# EAGLE schematic EAA690_RFID_Door (EAGLE 7.3.0)
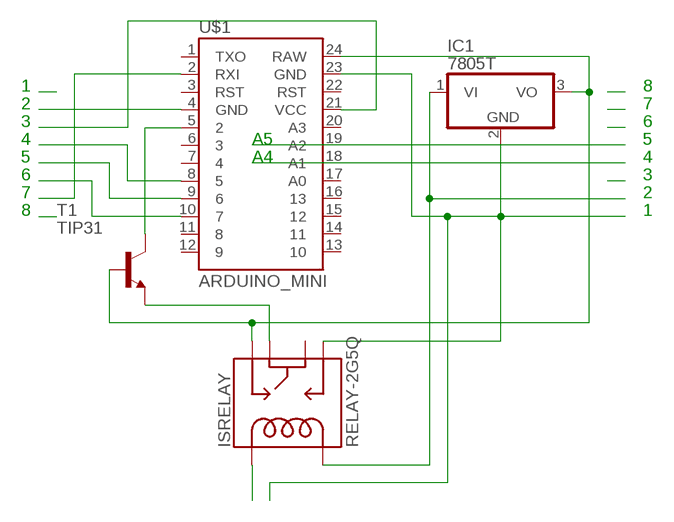
[diagram p0: schematic, sheet 1]

## Parts
IC1  7805T  [TO220H]
ISRELAY  RELAY-2G5Q  [RELAY-G5V]
T1  TIP31  [TO220]
U$1  ARDUINO_MINI  [ARDUINO_MINI]

## Nets
N$1: U$1.4(GND)
N$2: U$1.21(VCC)
N$3: U$1.8
N$4: U$1.9
N$5: U$1.10
N$6: U$1.2(RXI)
N$7: T1.2(C) U$1.5
N$8: IC1.3(VO) ISRELAY.1 T1.1(B) U$1.24(RAW)
N$9: IC1.2(GND) ISRELAY.10 U$1.23(GND)
N$11: ISRELAY.5 T1.3(E)
N$12: IC1.1(VI) ISRELAY.9
N$20: ISRELAY.2
Unconnected: ISRELAY.6 U$1.1(TXO) U$1.3(RST) U$1.6 U$1.7 U$1.11 U$1.12 U$1.13 U$1.14 U$1.15 U$1.16 U$1.17(A0) U$1.18(A1) U$1.19(A2) U$1.20(A3) U$1.22(RST)

## Notes on the sheet
- 1 | 8
- 2 | 7
- 3 | 6
- 4 | A5 | 5
- 5 | A4 | 4
- 6 | 3
- 7 | 2
- 8 | 1

## Library data of the parts
IC1 = linear:78*: Positive VOLTAGE REGULATOR Source: http://cache.national.com/ds/LM/LM78L05.pdf http://www.fairchildsemi.com/ds/LM/LM7805.pdf
ISRELAY = SparkFun-Electromechanical:RELAY-2: SPDT relay (COM-00100)
T1 = transistor:TIP31: NPN Transistor Medium Power Linear Switching Applications Source: http://onsemi.com
U$1 = SparkFun-Boards:ARDUINO_MINI: Arduino Pro Mini footprint